# Altium schematic sheet 6_Glosnik.SchDoc
size A4; Organization: Altium Limited; Address1: L3, 12a Rodborough Rd; Address2: Frenchs Forest; Address3: NSW; Address4: Australia 2086
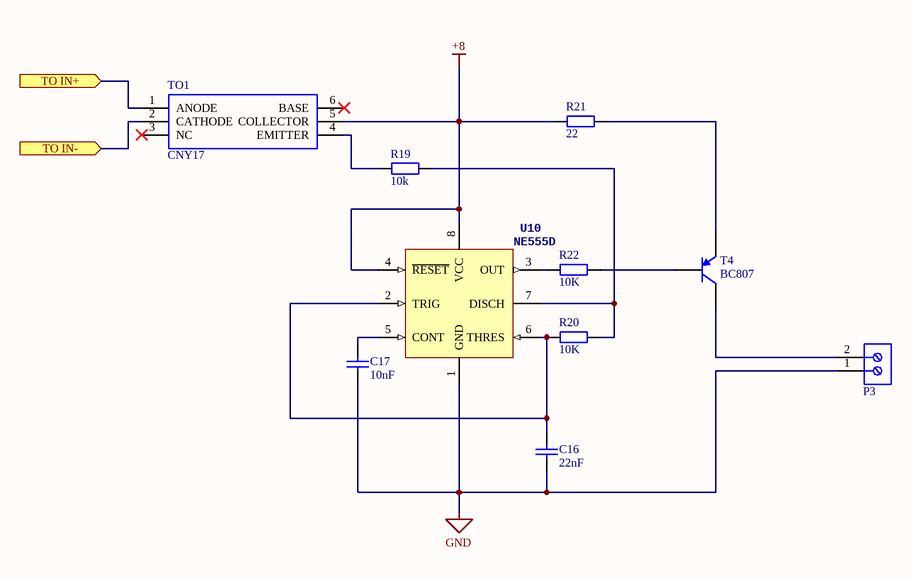
[diagram p0: 6_Glosnik.SchDoc]

## Parts
C16  Capacitance: 22nF  [CAPC1608X92X38NL15T08]  (hidden comment: VJ0603Y103KNAAO)
C17  Capacitance: 10nF  [CAPC1608X92X38NL15T08]  (hidden comment: VJ0603Y103KNAAO)
P3  282836-2 / SPEAKER  [TECO-282836-2_V]  (value not drawn)
R19  value 10k  [R1206]  (hidden comment: 1206S4J0103T5E@TME)
R20  value 10K  [R1206]  (hidden comment: 1206S4J0103T5E@TME)
R21  value 22  [R1206]  (hidden comment: 1206S4J0220T5E@TME)
R22  value 10K  [R1206]  (hidden comment: 1206S4J0103T5E@TME)
T4  BC807  [ONSC-SOT-23-3-318-08_V]
TO1  CNY17  [SOP254P1016X460-6N]
U10  NE555D  [D0008A_N]

## Ports
TO IN+ (in), TO IN- (in)

## Nets
+8: R21.2 TO1.5(COLLECTOR) U10.4(~{RESET}) U10.8(VCC)
GND: C16.2 C17.2 P3.1 U10.1(GND)
TO IN+: TO1.1(ANODE) ; port TO IN+
TO IN-: TO1.2(CATHODE) ; port TO IN-
NetC16_1: C16.1 R20.2 U10.2(TRIG) U10.6(THRES)
NetC17_1: C17.1 U10.5(CONT)
NetP3_2: P3.2 T4.3(C)
NetR19_1: R19.1 R20.1 U10.7(DISCH)
NetR19_2: R19.2 TO1.4(EMITTER)
NetR21_1: R21.1 T4.2(E)
NetR22_1: R22.1 T4.1(B)
NetR22_2: R22.2 U10.3(OUT)

Not connected (* = marked no-connect by the designer): TO1 3(NC)* 6(BASE)*

## Notes on the sheet
- Title
- Size:
- Date:
- A4
- Number:
- Time:
- Revision:
- Sheet
- of
- File:

## Library data of the parts
C16 C17 = CMP-2006-01968-1: Manufacturer: Vitramon; Part Number: VJ0603Y103KNAAO
P3 = CMP-1684-00017-1: Female Header, Pitch 5 mm, 1 x 2 Position, Height 10 mm, Tail Length 3.5 mm, Rohs, Bulk; Manufacturer: TE Connectivity; Wire Gauge: 16-30AWG; Product Training Modules: Wire-to-BoardEurostyleTerminalBlocks; Clamp Material - Plating: Brass-NickelPlated; Voltage: 300V; Mating Orientation: HorizontalwithBoard; Current: 13.5A; Pitch: 0.197"(5.00mm); Screw Thread: M3; 3D Model: 282836-2.pdf; Other Names: 5ULV-02B / A98076; Dynamic Catalog: BuchananSeries; Number of Levels: 1; Torque - Screw: 0.68Nm(6Lb-In); Featured Product: EurostyleTerminalBlockConnectors; Positions Per Level: 2; Wire Termination: Screw-RisingCageClamp; Datasheet URL: http://www.te.com.cn/commerce/DocumentDelivery/DDEController?Action=showdoc&DocId=Catalog+Section%7F1308389_EUROSTYLE_TERMINAL_BLOCKS%7F0607%7Fpdf%7FEnglish%7FENG_CS_1308389_EUROSTYLE_TERMINAL_BLOCKS_0607.pdf%7F282836-2; Color: Green; Family: TerminalBlocks-WiretoBoard; RoHS Information: 282836-2StatementofCompliance; Standard Package: 300; Contact Material - Plating: Brass-TinPlated; Manufacturer URL: http://www.te.com; Housing Material: Polyamide(PA66),Nylon6/6; Features: Interlocking(Side); Package Description: Female Header, Pitch 5 mm, 1 x 2 Position, Height 10 mm, Tail Length 3.5 mm; Mounting Type: ThroughHole; Package Reference: THD; Packaging: Bulk; Series: Buchanan; Category: Connectors,Interconnects; Screw Material - Plating: Brass-NickelPlated
R19-R22 = Res: Resistor
T4 = CMP-1048-00691-1: General Purpose Transistor, PNP Silicon, 3-Pin SOT-23, Pb-Free, Tape and Reel; Manufacturer: On Semiconductor; PartNumber: BC807-25LT1G; IC Continuous (A): -0.5; fT Min (MHz): 100; PackageDescription: 3-Pin Small Outline Transistor, Body 2.92 x 1.3 mm, Pitch 0.95 mm; Polarity: PNP; ComponentLink2URL: http://www.onsemi.com/pub_link/Collateral/BC807-16LT1-D.PDF; PackageReference: SOT-23-3-318-08; ComponentLink2Description: Datasheet; ComponentLink1Description: Manufacturer URL; ComponentLink3URL: http://www.onsemi.cn/pub_link/Collateral/318-08.PDF; Packing: Tape and Reel; DatasheetVersion: Rev. 10; RoHS: TRUE; ComponentLink3Description: Package Specification; PackageVersion: Rev. AP, 11/2009; ComponentLink1URL: http://www.onsemi.com/; Mounting Technology: Surface Mount
TO1 = CNY17-3-300E: Optocoupler DC i/p Transistor o/p DIP6GW Avago CNY17-3-300E DC Input Transistor Output Optocoupler, Surface Mount, 6-Pin PDIP; Manufacturer_Name: Avago Technologies; Geometry.Height: 4.6mm; Mouser Part Number: 630-CNY17-3-300E; Mouser Price/Stock: https://www.mouser.com/Search/Refine.aspx?Keyword=630-CNY17-3-300E; Manufacturer_Part_Number: CNY17-3-300E; Datasheet Link: https://componentsearchengine.com/Datasheets/2/CNY17-3-300E.pdf
U10 = CMP-2000-06840-1: Precision Timer, 4.5 to 16 V, 0 to 70 degC, 8-Pin SOIC (D), Green (RoHS & no Sb/Br), Tube; PartNumber: NE555; Manufacturer: Texas Instruments; Base Number: 555; No. of Timers: 1; Supply Voltage Min: 4.5V; Operating Frequency Max: 0.5MHz; Supply Voltage Range: 4.5Vto16V; No. of Pins: 8; Supply Voltage Max: 16V; IC Temperature Range: Commercial; SVHC: NoSVHC(19-Dec-2012); Operating Mode: Astable,Monostable; Frequency: 500kHz; Package Description: 8-Pin Small Outline Integrated Circuit, Body 4.9 x 3.9 mm, Pitch 1.27 mm; Datasheet URL: http://www.ti.com/general/docs/lit/getliterature.tsp?genericPartNumber=NE555&fileType=pdf; Mounting Technology: SurfaceMount; Operating Temperature Range: 0°Cto+70°C; Operating Temperature Min: 0°C; Package URL: http://www.ti.com/lit/ml/msoi002j/msoi002j.pdf; Datasheet Version: Rev. I, 09/2014; Manufacturer URL: http://www.ti.com/; Digital IC Case Style: SOIC; Clock External Input: No; Logic Function Number: 555; IC Generic Number: 555; No. of Channels: 1; Operating Temperature Max: 70°C; Package / Case: SOIC; Package Reference: D8; Device Marking: NE555D